# Altium schematic sheet Sheet2.SchDoc
size 152 x 101 mm
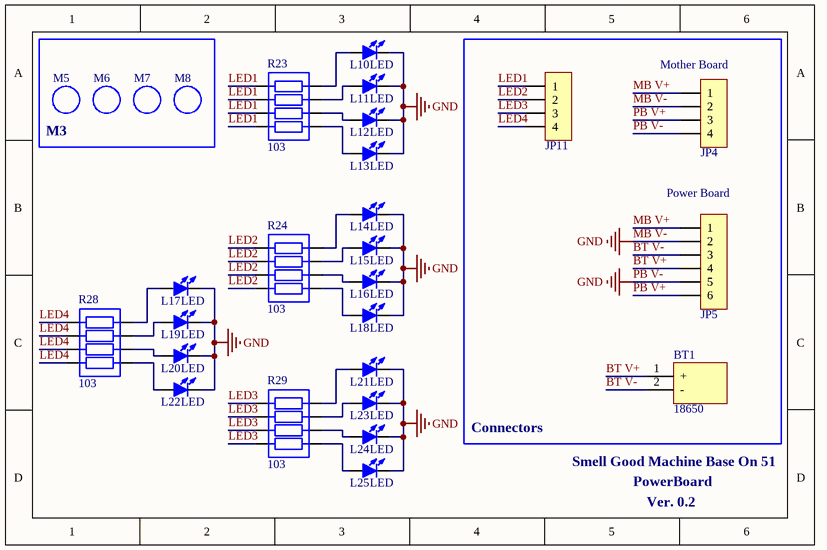
[diagram p0: Sheet2.SchDoc]

## Parts
BT1  18650  [18650_battery]
JP4  HDR-1X4  [HDR2.54-M-LI-4P]  (value not drawn)
JP5  HDR-1X6  [HDR2.54-M-LI-6P]  (value not drawn)
JP11  HDR-1X4  [HDR2.54-LI-4P]  (value not drawn)
L10  LED  [LED 0805G]
L11  LED  [LED 0805G]
L12  LED  [LED 0805G]
L13  LED  [LED 0805G]
L14  LED  [LED 0805G]
L15  LED  [LED 0805G]
L16  LED  [LED 0805G]
L17  LED  [LED 0805G]
L18  LED  [LED 0805G]
L19  LED  [LED 0805G]
L20  LED  [LED 0805G]
L21  LED  [LED 0805G]
L22  LED  [LED 0805G]
L23  LED  [LED 0805G]
L24  LED  [LED 0805G]
L25  LED  [LED 0805G]
M5  M3  [M3x20_N]  (value not drawn)
M6  M3  [M3x20_N]  (value not drawn)
M7  M3  [M3x20_N]  (value not drawn)
M8  M3  [M3x20_N]  (value not drawn)
R23  103  [RCA-8P4R-0603]
R24  103  [RCA-8P4R-0603]
R28  103  [RCA-8P4R-0603]
R29  103  [RCA-8P4R-0603]

## Blocks framed on the sheet
M3: M5-M8
Connectors: BT1 JP4 JP5 JP11

## Nets
MB V-: JP4.2 JP4.4 JP5.2 JP5.5 L10.2(K) L11.2(K) L12.2(K) L13.2(K) L14.2(K) L15.2(K) L16.2(K) L17.2(K) L18.2(K) L19.2(K) L20.2(K) L21.2(K) L22.2(K) L23.2(K) L24.2(K) L25.2(K)  [also labelled GND, PB V-]
BT V+: BT1.1(+) JP5.4
BT V-: BT1.2(-) JP5.3
LED1: JP11.1 R23.1 R23.2 R23.3 R23.4
LED2: JP11.2 R24.1 R24.2 R24.3 R24.4
LED3: JP11.3 R29.1 R29.2 R29.3 R29.4
LED4: JP11.4 R28.1 R28.2 R28.3 R28.4
MB V+: JP4.1 JP5.1
PB V+: JP4.3 JP5.6
NetL10_1: L10.1(A) R23.8
NetL11_1: L11.1(A) R23.7
NetL12_1: L12.1(A) R23.6
NetL13_1: L13.1(A) R23.5
NetL14_1: L14.1(A) R24.8
NetL15_1: L15.1(A) R24.7
NetL16_1: L16.1(A) R24.6
NetL17_1: L17.1(A) R28.8
NetL18_1: L18.1(A) R24.5
NetL19_1: L19.1(A) R28.7
NetL20_1: L20.1(A) R28.6
NetL21_1: L21.1(A) R29.8
NetL22_1: L22.1(A) R28.5
NetL23_1: L23.1(A) R29.7
NetL24_1: L24.1(A) R29.6
NetL25_1: L25.1(A) R29.5

## Notes on the sheet
- (near JP4) Mother Board
- (near JP5) Power Board
- Smell Good Machine Base On 51
- PowerBoard
- Ver. 0.2

## Library data of the parts
BT1 = 18650: Battery; 淘宝ID: 小糖豆的小窝窝; BOM名称: 18650; 下单链接: https://item.taobao.com/item.htm?ft=t&id=613637044352
JP4 JP11 = Header 4: 4P接插件; 淘宝ID: 小糖豆的小窝窝; BOM名称: 4P接插件; 下单链接: https://item.taobao.com/item.htm?ft=t&id=613637044352
JP5 = Header 6: 6P接插件; 淘宝ID: 小糖豆的小窝窝; BOM名称: 6P接插件; 下单链接: https://item.taobao.com/item.htm?ft=t&id=613637044352
L10-L25 = LED: 发光二极管; 淘宝ID: 小糖豆的小窝窝; BOM名称: 发光二极管; 下单链接: https://item.taobao.com/item.htm?ft=t&id=613637044352
M5-M8 = M3: 铜柱孔; 淘宝ID: 小糖豆的小窝窝; BOM名称: 铜柱孔; 下单链接: https://item.taobao.com/item.htm?ft=t&id=613637044352
R23 R24 R28 R29 = R-8P4R: 贴片排阻; 淘宝ID: 小糖豆的小窝窝; BOM名称: 贴片排阻; 下单链接: https://item.taobao.com/item.htm?ft=t&id=613637044352